# EAGLE design Pyr0-Piezo_Direct_Extruder_Board2.1.1 (EAGLE 9.4.2)
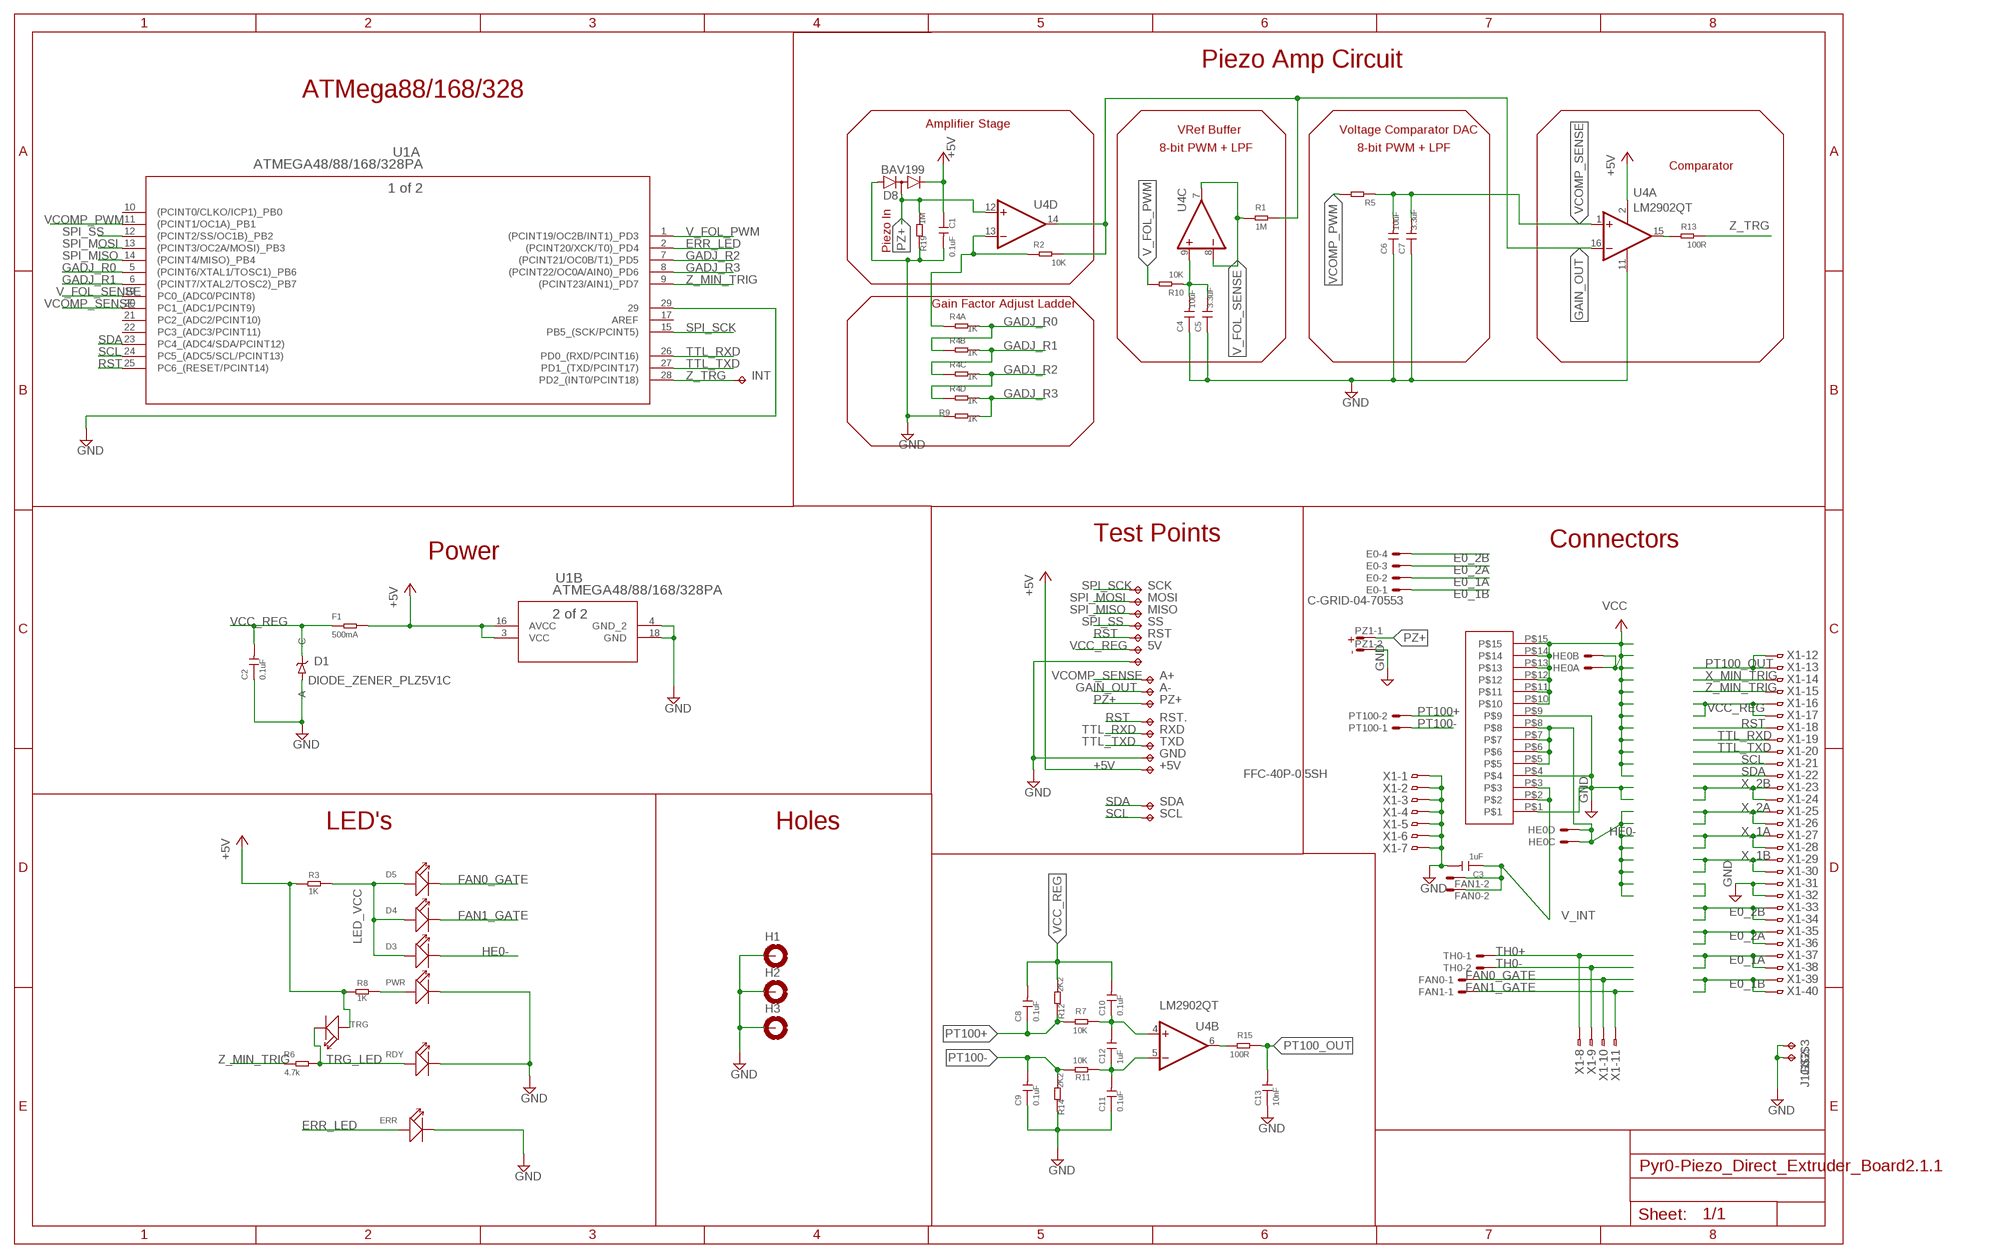
[diagram p0: schematic, sheet 1]

## Parts
5V  TPTP13SQ  [TP13SQ]
+5V  TPTP13SQ  [TP13SQ]
A+  TPTP13SQ  [TP13SQ]
A-  TPTP13SQ  [TP13SQ]
C1  0.1uF  CERAMIC-1NF-50V-10%-X7R(0402)CAP_0402  [CAPC1005X50]
C2  0.1uF  CERAMIC-1NF-50V-10%-X7R(0402)CAP_0402  [CAPC1005X50]
C3  1uF  SEEED-CAPACITOR_CERAMIC-10UF-25V-10%-X5R(0805)CAP_0603_GEN  [CAPC1609X80]
C4  10uF  CERAMIC-1NF-50V-10%-X7R(0402)CAP_0402  [CAPC1005X50]
C5  3.3uF  SEEED-CAPACITOR_CERAMIC-10UF-25V-10%-X5R(0805)CAP_0603_GEN  [CAPC1609X80]
C6  10uF  CERAMIC-1NF-50V-10%-X7R(0402)CAP_0402  [CAPC1005X50]
C7  3.3uF  SEEED-CAPACITOR_CERAMIC-10UF-25V-10%-X5R(0805)CAP_0603_GEN  [CAPC1609X80]
C8  0.1uF  CERAMIC-1NF-50V-10%-X7R(0402)CAP_0402  [CAPC1005X50]
C9  0.1uF  CERAMIC-1NF-50V-10%-X7R(0402)CAP_0402  [CAPC1005X50]
C10  0.1uF  CERAMIC-1NF-50V-10%-X7R(0402)CAP_0402  [CAPC1005X50]
C11  0.1uF  CERAMIC-1NF-50V-10%-X7R(0402)CAP_0402  [CAPC1005X50]
C12  1uF  CERAMIC-1NF-50V-10%-X7R(0402)CAP_0402  [CAPC1005X50]
C13  10nF  CERAMIC-1NF-50V-10%-X7R(0402)CAP_0402  [CAPC1005X50]
D1  DIODE_ZENER_PLZ5V1C  [DO-219AC]
D3  SEEED-LED_SMD-LED-CLEAR-BLUE(0603)LED_0603  [SEEED-LED_LED-0603]
D4  SEEED-LED_SMD-LED-CLEAR-BLUE(0603)LED_0603  [SEEED-LED_LED-0603]
D5  SEEED-LED_SMD-LED-CLEAR-BLUE(0603)LED_0603  [SEEED-LED_LED-0603]
D8  BAV199  [SOT23]
E0  C-GRID-04-70553  [70553-04]
ERR  SEEED-LED_SMD-LED-CLEAR-BLUE(0603)LED_0603  [SEEED-LED_LED-0603]
F1  500mA  SEEED-RESISTOR_SMD-RES-1.5K-1%-1/10W(0603)DETAILED_MODEL  [SEEED-RESISTOR_R0603]
FAN0  CON-MOLEX-2P-1.27MM048  [53048-02]
FAN1  CON-MOLEX-2P-1.27MM048  [53048-02]
GND  TPTP13SQ  [TP13SQ]
H1  HOLES_MOUNT-PAD-ROUND3.2  [HOLES_3,2-PAD]
H2  HOLES_MOUNT-PAD-ROUND3.2  [HOLES_3,2-PAD]
H3  HOLES_MOUNT-PAD-ROUND3.2  [HOLES_3,2-PAD]
HE0  JST-2.54-2X2JST-DUPONT-2.54-2X2  [HDRRAR4W64P254_2X2_556X736X556B]
INT  TPTP06R  [TP06R]
J1  FFC-15P-1MM  [FFC-15P-1MM]
MISO  TPTP13SQ  [TP13SQ]
MOSI  TPTP13SQ  [TP13SQ]
PT100  CON-MOLEX-2P-1.27MM048  [53048-02]
PWR  SEEED-LED_SMD-LED-CLEAR-BLUE(0603)LED_0603  [SEEED-LED_LED-0603]
PZ1  CON-MOLEX-2P-1.27MM048  [53048-02]
PZ+  TPTP13SQ  [TP13SQ]
R1  1M  SMD-RES-0R-5%-1/16W(0402)  [R0402]
R2  10K  SMD-RES-0R-5%-1/16W(0402)  [R0402]
R3  1K  SMD-RES-0R-5%-1/16W(0402)  [R0402]
R4  1K  RESISTOR_NETWORK_X40804  [EXBN8V]
R5  10K  SEEED-RESISTOR_SMD-RES-1.5K-1%-1/10W(0603)DETAILED_MODEL  [SEEED-RESISTOR_R0603]
R6  4.7k  SMD-RES-0R-5%-1/16W(0402)  [R0402]
R7  10K  SMD-RES-0R-5%-1/16W(0402)  [R0402]
R8  1K  SMD-RES-0R-5%-1/16W(0402)  [R0402]
R9  1K  SMD-RES-0R-5%-1/16W(0402)  [R0402]
R10  10K  SMD-RES-0R-5%-1/16W(0402)  [R0402]
R11  10K  SMD-RES-0R-5%-1/16W(0402)  [R0402]
R12  2K2  SMD-RES-0R-5%-1/16W(0402)  [R0402]
R13  100R  SMD-RES-0R-5%-1/16W(0402)  [R0402]
R14  2K2  SMD-RES-0R-5%-1/16W(0402)  [R0402]
R15  100R  SMD-RES-0R-5%-1/16W(0402)  [R0402]
R19  1M  SMD-RES-0R-5%-1/16W(0402)  [R0402]
RDY  SEEED-LED_SMD-LED-CLEAR-BLUE(0603)LED_0603  [SEEED-LED_LED-0603]
RST  TPTP13SQ  [TP13SQ]
RST.  TPTP13SQ  [TP13SQ]
RXD  TPTP13SQ  [TP13SQ]
SCK  TPTP13SQ  [TP13SQ]
SCL  TPTP13SQ  [TP13SQ]
SDA  TPTP13SQ  [TP13SQ]
SS  TPTP06R  [TP06R]
TH0  CON-MOLEX-2P-1.27MM048  [53048-02]
TRG  SEEED-LED_SMD-LED-CLEAR-BLUE(0603)LED_0603  [SEEED-LED_LED-0603]
TXD  TPTP13SQ  [TP13SQ]
U1  ATMEGA48/88/168/328PA  [28M1]
U4  LM2902QT  [QFN16]
X1  FFC-40P-0.5SH  [FH12-40S-0.5SH]
⏚  TPTP13SQ  [TP13SQ]

## Nets
+5V: +5V.TP C1.1 D8.2(C) F1.2 R3.1 R8.1 TRG.+ U1.3(B:VCC) U1.16(B:AVCC) U4.2(P:V+)
E0_1A: E0.2 X1.37 X1.38
E0_1B: E0.1 X1.39 X1.40
E0_2A: E0.3 X1.35 X1.36
E0_2B: E0.4 X1.33 X1.34
ERR_LED: ERR.+ U1.2(A:(PCINT20/XCK/T0)_PD4)
FAN0_GATE: D5.- FAN0.1 X1.10
FAN1_GATE: D4.- FAN1.1 X1.11
GADJ_R0: R4.2 R4.8 U1.5(A:(PCINT6/XTAL1/TOSC1)_PB6)
GADJ_R1: R4.3 R4.7 U1.6(A:(PCINT7/XTAL2/TOSC2)_PB7)
GADJ_R2: R4.4 R4.6 U1.7(A:(PCINT21/OC0B/T1)_PD5)
GADJ_R3: R4.5 R9.2 U1.8(A:(PCINT22/OC0A/AIN0)_PD6)
GAIN_FB: R2.1 R4.1 U4.13(D:-IN)
GAIN_OUT: A-.TP R1.2 R2.2 U4.14(D:OUT) U4.16(A:-IN)
GND: C1.2 C2.1 C3.2 C4.1 C5.1 C6.1 C7.1 C9.1 C11.1 C13.1 D1.P$1(A) D8.1(A) ERR.- GND.TP H1.B3,2(MOUNT) H2.B3,2(MOUNT) H3.B3,2(MOUNT) J1.P$1 J1.P$4 J1.P$9 J1.P$16(TP) J1.P$17(TP) PWR.- PZ1.2 R9.1 R14.1 R19.1 RDY.- U1.4(B:GND_2) U1.18(B:GND) U1.29 U4.11(P:V-) X1.1 X1.2 X1.3 X1.4 X1.5 X1.6 X1.7 X1.31 X1.32 ⏚.TP
HE0-: D3.- HE0.3 HE0.4 J1.P$5 J1.P$6 J1.P$7 J1.P$8
LED_VCC: D3.+ D4.+ D5.+ R3.2
N$2: PWR.+ R8.2
PT100+: C8.1 PT100.2 R7.2 R12.1
PT100-: C9.2 PT100.1 R11.2 R14.2
PT100_AMP+: C10.1 C12.2 R7.1 U4.4(B:+IN)
PT100_AMP-: C11.2 C12.1 R11.1 U4.5(B:-IN)
PT100_OUT: C13.2 R15.1 X1.12 X1.13
PT100_R: R15.2 U4.6(B:OUT)
PZ+: D8.3(AC) PZ1.1 PZ+.TP R19.2 U4.12(D:+IN)
PZ_AMP_OUT: R13.1 U4.15(A:OUT)
RST: RST..TP RST.TP U1.25(A:PC6_(RESET/PCINT14)) X1.18
SCL: SCL.TP U1.24(A:PC5_(ADC5/SCL/PCINT13)) X1.21
SDA: SDA.TP U1.23(A:PC4_(ADC4/SDA/PCINT12)) X1.22
SPI_MISO: MISO.TP U1.14(A:(PCINT4/MISO)_PB4)
SPI_MOSI: MOSI.TP U1.13(A:(PCINT3/OC2A/MOSI)_PB3)
SPI_SCK: SCK.TP U1.15(A:PB5_(SCK/PCINT5))
SPI_SS: SS.TP U1.12(A:(PCINT2/SS/OC1B)_PB2)
TH0+: TH0.1 X1.8
TH0-: TH0.2 X1.9
TRG_LED: R6.2 RDY.+ TRG.-
TTL_RXD: RXD.TP U1.26(A:PD0_(RXD/PCINT16)) X1.19
TTL_TXD: TXD.TP U1.27(A:PD1_(TXD/PCINT17)) X1.20
V_FOL_PWM: R10.2 U1.1(A:(PCINT19/OC2B/INT1)_PD3)
V_FOL_SENSE: R1.1 U1.19(A:PC0_(ADC0/PCINT8)) U4.7(C:OUT) U4.8(C:-IN)
V_INT: C3.1 FAN0.2 FAN1.2 J1.P$2 J1.P$3
VCC: HE0.1 HE0.2 J1.P$10 J1.P$11 J1.P$12 J1.P$13 J1.P$14 J1.P$15
VCC_REG: 5V.TP C2.2 C8.2 C10.2 D1.P$2(C) F1.1 R12.2 X1.16 X1.17
VCOMP_PWM: R5.2 U1.11(A:(PCINT1/OC1A)_PB1)
VCOMP_SENSE: A+.TP C6.2 C7.2 R5.1 U1.20(A:PC1_(ADC1/PCINT9)) U4.1(A:+IN)
VREF_IN: C4.2 C5.2 R10.1 U4.9(C:+IN)
X_1A: X1.27 X1.28
X_1B: X1.29 X1.30
X_2A: X1.25 X1.26
X_2B: X1.23 X1.24
X_MIN_TRIG: X1.14
Z_MIN_TRIG: R6.1 U1.9(A:(PCINT23/AIN1)_PD7) X1.15
Z_TRG: INT.TP R13.2 U1.28(A:PD2_(INT0/PCINT18))
Unconnected: U1.10(A:(PCINT0/CLKO/ICP1)_PB0) U1.17(A:AREF) U1.21(A:PC2_(ADC2/PCINT10)) U1.22(A:PC3_(ADC3/PCINT11))

## Notes on the sheet
- Piezo Amp Circuit
- ATMega88/168/328
- Amplifier Stage
- VRef Buffer | Voltage Comparator DAC
- 8-bit PWM + LPF | 8-bit PWM + LPF
- Comparator
- Piezo In
- Gain Factor Adjust Ladder
- Test Points | Connectors
- Power
- -  +
- LED's | Holes

## Library data of the parts
5V A+ A- MISO MOSI PZ+ RST SCK = PiezoFFC:TP: Test pad
+5V GND INT RST. RXD SCL SDA SS TXD ⏚ = testpad:TP: Test pad
C1 C2 C4 C6 C8-C13 = PiezoFFC:CERAMIC-1NF-50V-10%-X7R(0402): 302010005
C3 C5 C7 = PiezoFFC:SEEED-CAPACITOR_CERAMIC-10UF-25V-10%-X5R(0805): 302010178
D1 = PiezoFFC:DIODE_ZENER_PLZ5V1C
D3-D5 ERR PWR RDY TRG = PiezoFFC:SEEED-LED_SMD-LED-CLEAR-BLUE(0603): 304090045
D8 = PiezoFFC:BAV199: DIODE low-leakage double diode
E0 = PiezoFFC:C-GRID-04: CONNECTOR wire to board 2.54 mm (0.100") pitch header; MF: MOLEX; OC_FARNELL: unknown; OC_NEWARK: unknown
F1 R5 = PiezoFFC:SEEED-RESISTOR_SMD-RES-1.5K-1%-1/10W(0603): 301010189
FAN0 FAN1 PT100 PZ1 TH0 = PiezoFFC:CON-MOLEX-2P-1.27MM: CONNECTOR wire to board 1.25 mm (.049 inch) pitch header; MF: MOLEX; MPN: 53048-0210; OC_FARNELL: 1012259; OC_NEWARK: 57H4718
H1-H3 = PiezoFFC:HOLES_MOUNT-PAD-ROUND: MOUNTING PAD, round
HE0 = PiezoFFC:JST-2.54-2X2
J1 = PiezoFFC:FFC-15P-1MM
R1-R3 R6-R15 R19 = PiezoFFC:SMD-RES-0R-5%-1/16W(0402): 301010000; MPN: RC0402JR-070RL; VALUE: 0R
R4 = PiezoFFC:RESISTOR_NETWORK_X4
U1 = PiezoFFC:ATMEGA48/88/168/328PA; MANUFACTURER_PART_NUMBER: ATMEGA48PAMMHR; VENDOR: Atmel
U4 = PiezoFFC:LM2902: Low power quad operational amplifier Source: Data sgeet <http://www.st.com/internet/com/TECHNICAL_RESOURCES/TECHNICAL_LITERATURE/DATASHEET/CD00000533.pdf>
X1 = PiezoFFC:FFC-40P-0.5S: 0.5mm Pitch Connectors For FPC/FFC Source: Data sheet <http://www.hirose.co.jp/cataloge_hp/e58605370.pdf>; MPN: FH12-40S-0.5SH(55); OC_FARNELL: 1324556; OC_NEWARK: 34M6178

## Board
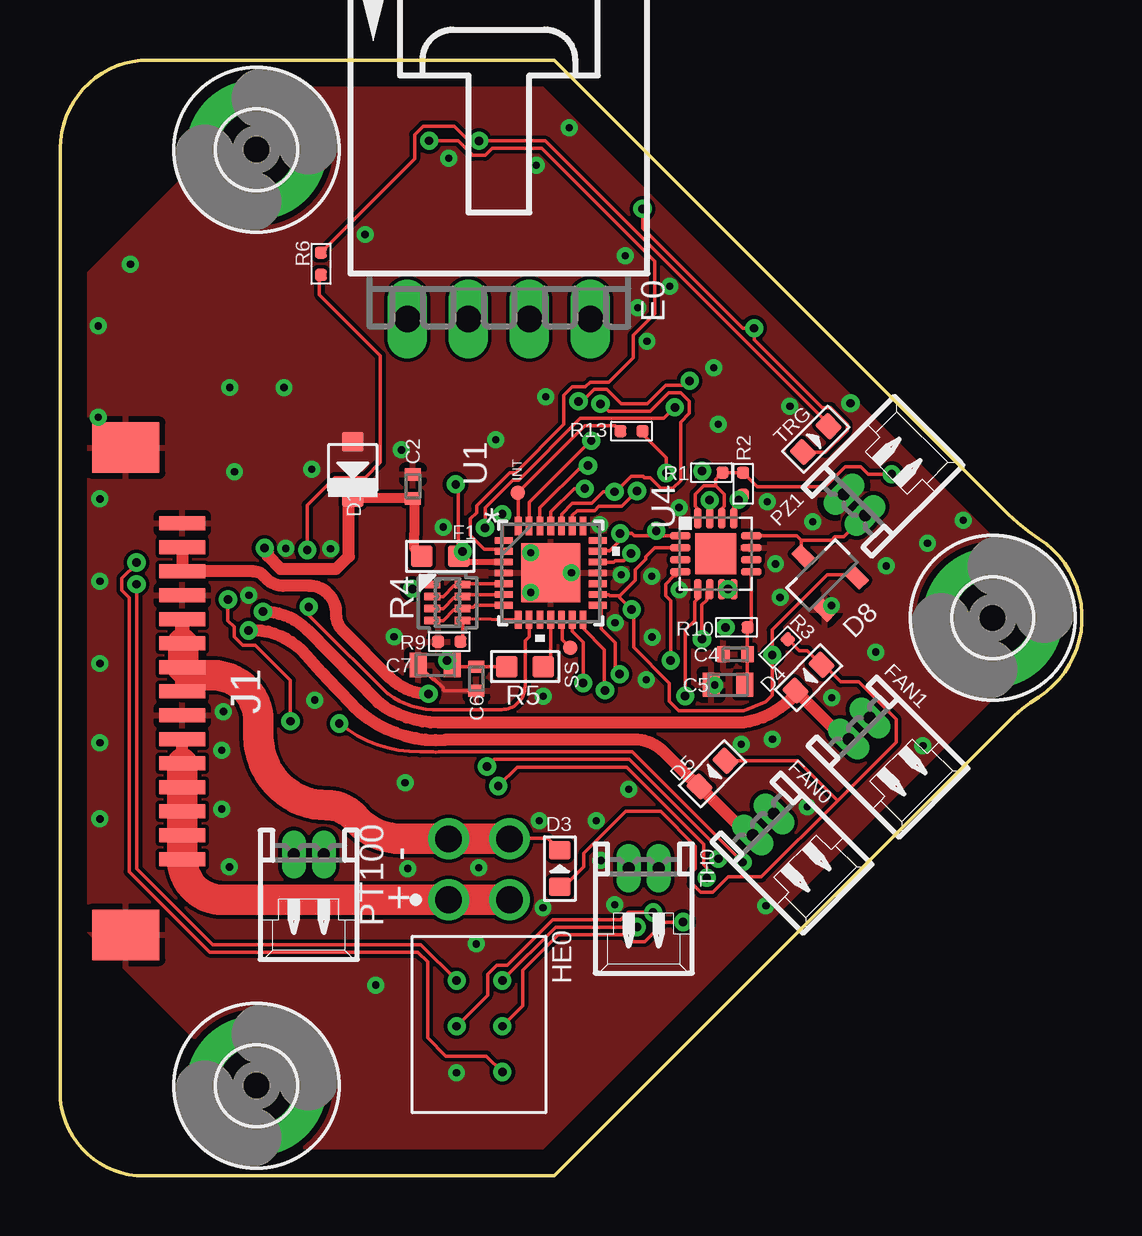
[diagram p1: board, top side]
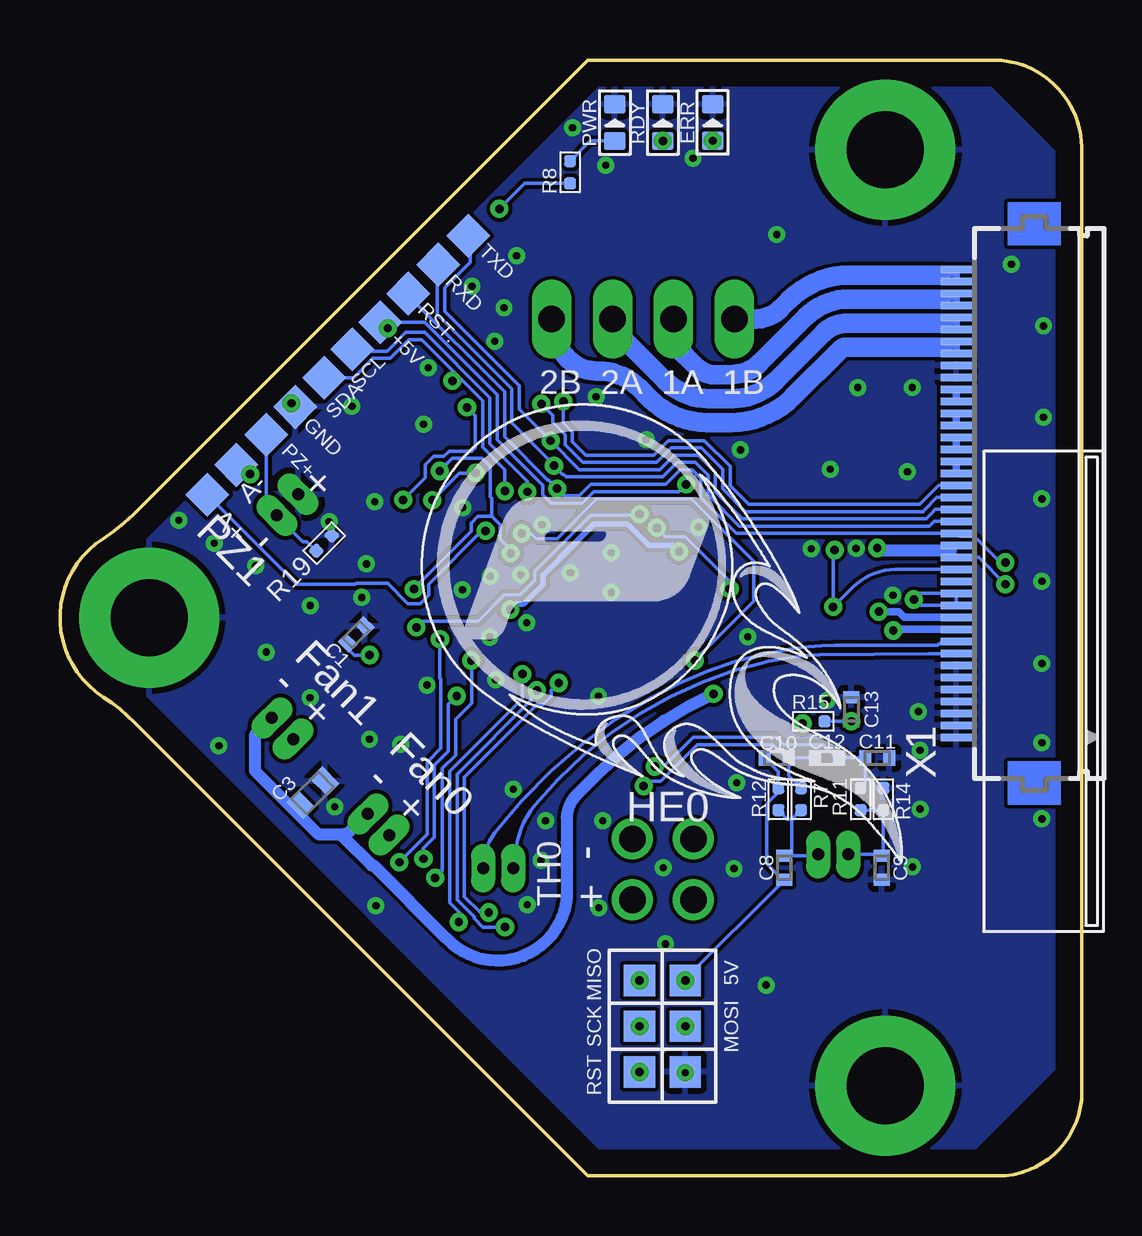
[diagram p2: board, bottom side, seen from below]

Size 42.58 x 46.48 mm. Coordinates in mm from the lower left corner, seen from the top.
Outline: 22.46,1.87 39.46,18.87 arc-12 40.78,19.94 arc114 40.78,26.54 arc-12 39.51,27.56 20.59,46.48 8.14,46.48 3.7,46.48 arc90 0.01,42.8 0.01,3.81 arc90 3.19,0 8.27,0 20.59,0 22.46,1.87
Copper layers (1*16): Top 0.035mm / dielectric 1.5mm / Bottom 0.035mm
Design rules "default *": minimum track width 6mil, minimum drill 0.35mm, track to track 6mil, track to pad 6mil, pad to pad 6mil, via to via 6mil, smd to smd 6mil, copper to edge 40mil, drill to drill 6mil, minimum pad ring 10mil, minimum via ring 8mil, stop-mask expansion 4mil, vias tented up to drill 4mm, thermal gap 10mil

### Footprints (pad centres in the part's own frame; a part is rotated, then mirrored left to right if it is on the bottom)
TP13SQ = smd 1.3 x 1.3: TP 0,0
CAPC1005X50 = smd 0.512 x 0.662: 1 -0.5,0; 2 0.5,0
CAPC1609X80 = smd 0.712 x 1.012: 1 -0.7,0; 2 0.7,0
DO-219AC = smd 0.8 x 0.9: P$1 -1.15,0; P$2 1.15,0
SEEED-LED_LED-0603 = smd 0.762 x 0.889: + -0.762,0; - 0.762,0
SOT23 = smd 0.6 x 0.9: 1 -0.95,-1.1; 2 0.95,-1.1; 3 0,1.1
70553-04 = drill 1.092 long: 1 -3.81,-7.62; 2 -1.27,-7.62; 3 1.27,-7.62; 4 3.81,-7.62
SEEED-RESISTOR_R0603 = smd 0.889 x 0.889: 1 0,0.762; 2 0,-0.762
53048-02 = drill 0.5 pad 0.698 long: 1 0.625,-1.25; 2 -0.625,-1.25
HOLES_3,2-PAD = drill 3.2 pad 5.842: B3,2 0,0
HDRRAR4W64P254_2X2_556X736X556B = drill 1.105 pad 1.705: 1 0,0; 2 2.54,0; 3 2.54,2.54; 4 0,2.54
TP06R = smd 0.6 x 0.6: TP 0,0
FFC-15P-1MM = smd 0.6 x 1.9: P$1 0,0; P$2 1,0; P$3 2,0; P$4 3,0; P$5 4,0; P$6 5,0; P$7 6,0; P$8 7,0; P$9 8,0; P$10 9,0; P$11 10,0; P$12 11,0; P$13 12,0; P$14 13,0; P$15 14,0 | smd 2.1 x 2.8: P$16 -3.15,-2.35; P$17 17.15,-2.35
R0402 = smd 0.5 x 0.5: 1 0,0.463; 2 0,-0.463
EXBN8V = smd 0.657 x 0.3: 1 -0.629,0.75; 2 -0.629,0.25; 3 -0.629,-0.25; 4 -0.629,-0.75; 5 0.629,-0.75; 6 0.629,-0.25; 7 0.629,0.25; 8 0.629,0.75
28M1 = smd 0.762 x 0.279: 1 -1.956,1.35; 2 -1.956,0.9; 3 -1.956,0.45; 4 -1.956,0; 5 -1.956,-0.45; 6 -1.956,-0.9; 7 -1.956,-1.35; 15 1.956,-1.35; 16 1.956,-0.9; 17 1.956,-0.45; 18 1.956,0; 19 1.956,0.45; 20 1.956,0.9; 21 1.956,1.35 | smd 0.279 x 0.762: 8 -1.35,-1.956; 9 -0.9,-1.956; 10 -0.45,-1.956; 11 0,-1.956; 12 0.45,-1.956; 13 0.9,-1.956; 14 1.35,-1.956; 22 1.35,1.956; 23 0.9,1.956; 24 0.45,1.956; 25 0,1.956; 26 -0.45,1.956; 27 -0.9,1.956; 28 -1.35,1.956 | smd 2.464 x 2.464: 29 0,0
QFN16 = smd 0.85 x 0.3: 1 -1.475,0.75; 2 -1.475,0.25; 3 -1.475,-0.25; 4 -1.475,-0.75; 9 1.475,-0.75; 10 1.475,-0.25; 11 1.475,0.25; 12 1.475,0.75 | smd 0.3 x 0.85: 5 -0.75,-1.475; 6 -0.25,-1.475; 7 0.25,-1.475; 8 0.75,-1.475; 13 0.75,1.475; 14 0.25,1.475; 15 -0.25,1.475; 16 -0.75,1.475 | smd 1.7 x 1.7: TH 0,0
FH12-40S-0.5SH = smd 0.3 x 1.3: 1 -9.75,3.25; 2 -9.25,3.25; 3 -8.75,3.25; 4 -8.25,3.25; 5 -7.75,3.25; 6 -7.25,3.25; 7 -6.75,3.25; 8 -6.25,3.25; 9 -5.75,3.25; 10 -5.25,3.25; 11 -4.75,3.25; 12 -4.25,3.25; 13 -3.75,3.25; 14 -3.25,3.25; 15 -2.75,3.25; 16 -2.25,3.25; 17 -1.75,3.25; 18 -1.25,3.25; 19 -0.75,3.25; 20 -0.25,3.25; 21 0.25,3.25; 22 0.75,3.25; 23 1.25,3.25; 24 1.75,3.25; 25 2.25,3.25; 26 2.75,3.25; 27 3.25,3.25; 28 3.75,3.25; 29 4.25,3.25; 30 4.75,3.25; 31 5.25,3.25; 32 5.75,3.25; 33 6.25,3.25; 34 6.75,3.25; 35 7.25,3.25; 36 7.75,3.25; 37 8.25,3.25; 38 8.75,3.25; 39 9.25,3.25; 40 9.75,3.25

### Placement (x,y rotation side)
5V  16.52,8.13 0 bottom
+5V  29.24,35.56 135 bottom
A+  36.45,28.36 45 bottom
A-  35.23,29.61 225 bottom
C1  30.24,22.54 45 bottom
C2  14.71,28.71 270 top
C3  32.05,15.94 45 bottom
C4  28.14,21.72 0 top
C5  27.83,20.45 0 top
C6  17.35,20.7 90 top
C7  15.64,21.27 0 top
C8  12.4,12.83 270 bottom
C9  8.33,12.83 90 bottom
C10  12.71,17.4 180 bottom
C11  8.52,17.4 180 bottom
C12  10.62,17.4 180 bottom
C13  9.6,19.43 270 bottom
D1  12.2,29.43 270 top
D3  20.83,12.79 90 top
D4  31.19,20.75 225 top
D5  27.19,16.75 225 top
D8  31.75,25.02 45 top
E0  18.29,43.31 0 top
ERR  15.38,43.88 90 bottom
F1  15.84,25.8 90 top
FAN0  30.19,13.75 225 top
FAN1  34.19,17.75 225 top
GND  32.78,32.02 315 bottom
H1  8.19,3.75 0 top
H2  8.19,42.75 0 top
H3  38.86,23.24 0 top
HE0  16.19,11.49 0 top
INT  19.08,28.45 180 top
J1  5.09,27.18 270 top
MISO  18.43,8.13 0 bottom
MOSI  16.52,6.22 0 bottom
PT100  10.36,12.13 180 top
PWR  19.46,43.87 90 bottom
PZ1  33.99,28.83 315 top
PZ+  33.99,30.86 45 bottom
R1  27.14,29.29 90 top
R2  28.46,28.83 180 top
R3  30.01,22.02 135 top
R4  16.14,23.88 0 top
R5  19.38,21.21 90 top
R6  10.87,37.99 180 top
R7  11.7,15.68 0 bottom
R8  21.32,41.8 180 bottom
R9  16.22,22.24 90 top
R10  28.19,22.84 270 top
R11  9.22,15.68 0 bottom
R12  12.65,15.68 180 bottom
R13  23.81,31.02 270 top
R14  8.27,15.68 0 bottom
R15  11.19,18.92 270 bottom
R19  31.57,26.35 315 bottom
RDY  17.46,43.87 90 bottom
RST  18.43,4.32 0 bottom
RST.  28.07,36.75 315 bottom
RXD  26.82,37.96 135 bottom
SCK  18.43,6.22 0 bottom
SCL  30.41,34.42 315 bottom
SDA  31.57,33.24 315 bottom
SS  21.27,21.99 90 top
TH0  24.32,11.56 180 top
TRG  31.49,30.68 45 top
TXD  25.57,39.16 135 bottom
U1  20.45,25.11 0 top
U4  27.32,25.91 0 top
U$1  [LOGO-PYR0BALL-SS-20MM]  20.73,25.51 0 bottom
X1  1.98,28 90 bottom
⏚  16.52,4.32 0 bottom

### Tracks (layer width: path | path; a pad name or v marks a point on that pad's centre or on a via)
+5V  (via drill 0.35)
  Top 0.152: v24.27,40.28 24.27,39.48 28.45,35.31 v28.92,35.31 28.92,34.83 31.76,32 32.12,32 32.8,31.31 32.8,31.04 31.89,30.13 30.96,30.13 TRG.+ | D8.2 33.08,25.04 31.98,25.04 29.68,22.74 R3.1 29.68,20.01 29.41,19.75 28.49,19.37 25.79,19.37 25.39,19.77 25.39,20.52 23.9,22.01 23.9,23.5 v23.82,23.59 23.33,24.08 | U1.16 22.86,24.21 22.91,24.15 23.25,24.15 23.33,24.08 | v16.49,28.8 16.59,28.7 16.59,25.82 F1.2 | U4.2 24.78,26.16 24.4,25.79 24.4,25.67 23.96,25.23 23.96,24.8 23.33,24.16 23.33,24.08
  Top 0.254: U1.3 16.87,25.56 16.63,25.8 F1.2 16.61,25.83 v16.78,26
  Bottom 0.152: v24.27,40.28 23.22,41.34 R8.1 | R3.1 30.32,21.69 30.61,21.98 30.61,22.17 C1.1 | +5V.TP 28.99,35.31 v28.92,35.31 28.67,35.56 27.39,35.56 24.36,32.53 24.36,30.65 22.49,28.79 22.47,28.77 22.47,28.37 22.12,28.02 20.82,28.02 20.33,28.5 16.79,28.5 v16.49,28.8
  Bottom 0.254: v23.82,23.59 23.57,23.84 23.26,23.84 22.44,24.65 22.44,25.02 21.75,25.72 | 21.75,25.72 | 21.75,25.72 20.31,27.15 18.95,27.15 18.05,26.26 17.03,26.26 v16.78,26
  other vias: 29.68,21.69
E0_1A
  Bottom 0.305: X1.37 X1.38 arc45 5.79,36.52 5.86,36.52
  Bottom 0.813: E0.2 17.02,35.35 arc-45 16.52,34.16 16.02,33.65 arc-45 15.34,33.37 14.61,33.37 arc-45 13.41,33.87 11.5,35.78 arc45 9.71,36.52 5.86,36.52
E0_1B
  Bottom 0.305: X1.39 X1.40 arc45 5.79,37.52 5.86,37.52
  Bottom 0.813: E0.1 13.61,35.69 arc-45 12.56,36.12 12.22,36.47 arc45 9.67,37.52 5.86,37.52
E0_2A
  Bottom 0.305: X1.35 X1.36 arc45 5.79,35.52 5.81,35.52
  Bottom 0.813: E0.3 arc-45 19.3,35.06 17.35,33.12 arc-45 15.56,32.37 14.56,32.37 arc-45 12.77,33.12 10.78,35.1 arc45 9.76,35.52 5.81,35.52
E0_2B
  Bottom 0.305: X1.33 X1.34 arc45 5.79,34.52 5.81,34.52
  Bottom 0.813: E0.4 E0.4 arc-45 21.41,34.02 arc-45 20.2,33.52 20.16,33.52 arc45 18.45,32.82 18.01,32.37 arc-45 15.6,31.37 14.62,31.37 arc-45 12.04,32.44 10.07,34.41 arc45 9.81,34.52 5.81,34.52
ERR_LED  (via drill 0.35)
  Top 0.152: ERR.+ 16.6,43.12 17.21,42.5 17.71,42.5 18.01,42.81 20.07,42.81 24.78,38.1 24.78,35.91 23.88,35.01 23.88,34.07 22.87,33.06 22.09,33.06 21.89,32.86 21.35,32.86 21,32.51 21,31.3 18.99,29.28 18.73,29.28 17.35,27.91 17.35,27.62 17.1,27.37 17.1,26.67 17.68,26.09 18.46,26.09 U1.2
  other vias: 15.38,43.12
FAN0_GATE  (via drill 0.35)
  Top 0.508: FAN0.1 28.67,14.19 D5.- 26.18,16.64 25.16,17.65 arc50 23.76,18.16 16.08,18.16 arc-49 12.2,19.59 arc-5 10.25,21.69 arc41 8.4,22.71 v7.86,22.71
  Bottom 0.305: v7.86,22.71 7.66,22.71 7.61,22.75 X1.10
FAN1_GATE  (via drill 0.35)
  Top 0.508: FAN1.1 32.67,18.19 D4.- 30.65,20.06 30.46,19.87 arc-37 28.46,18.87 15.77,18.87 arc-37 13.26,19.71 arc1 10.3,22.74 arc45 v8.46,23.5
  Bottom 0.305: v8.46,23.5 7.63,23.5 7.39,23.25 X1.11
GADJ_R0
  Top 0.152: U1.5 16.81,24.66 R4.8 16.71,24.57 16.41,24.57 15.97,24.13 R4.2
GADJ_R1
  Top 0.152: U1.6 18.52,24.19 16.84,24.19 R4.7 16.71,24.07 16.41,24.07 15.97,23.63 R4.3
GADJ_R2
  Top 0.152: U1.7 17.3,23.76 17.23,23.69 16.84,23.69 R4.6 16.71,23.57 16.41,23.57 15.97,23.13 R4.4
GADJ_R3
  Top 0.152: U1.8 16.85,23.21 R4.5 16.77,22.34 R9.2
GAIN_FB  (via drill 0.35)
  Top 0.152: U4.13 28.07,27.97 R2.1 28.46,28.33 v28.28,28.15 | v25.62,32.01 25.16,31.55 21.68,31.55 19.11,28.98 18.86,28.98 17.71,27.83 v17.71,26.99 | R4.1 15.45,24.56 14.8,24.56 v14.68,24.45
  Bottom 0.152: v28.28,28.15 27.36,29.07 27.36,29.61 27.01,29.96 26.58,29.96 26.36,30.19 25.41,30.19 25.27,30.33 25.27,31.67 v25.62,32.01 | v17.71,26.99 17.33,26.61 16.53,26.61 14.71,24.8 14.71,24.48 v14.68,24.45
GAIN_OUT  (via drill 0.35)
  Top 0.152: 27.32,28.75 26.82,28.75 26.46,28.39 26.46,27.89 26.57,27.78 U4.16 | 27.32,28.75 27.68,28.39 27.68,27.89 27.57,27.78 U4.14 | 27.32,28.75 27.32,29 R1.2 R2.2 29.05,28.7 31.89,28.7 32.72,29.53 33.37,29.53 33.67,29.23 v34.66,29.23
  Bottom 0.152: A-.TP 35.04,29.61 v34.66,29.23
GND  (via drill 0.3, 0.35)
  Top 0.152: C6.1 16.01,20.2 15.96,20.25 15.96,20.32 15.6,20.68 15.53,20.68 C7.1
  other vias: 23.38,25.04 27.43,31.31 23.56,38.33 21.31,25.12 10.49,29.43 35.96,17.91 29.68,18.18 2.94,37.97 36.15,26.35 1.67,28.19 1.67,24.77 1.67,21.34 1.67,18.03 1.67,14.86 13.16,7.94 6.75,17.72 7.87,24.18 15.97,27.02 11.27,26.12 20.24,32.45 19.97,14.78 24.67,22.44 22.35,14.78 21.22,43.66 28.38,17.97 24.43,20.66 31.13,15.37 29.41,11.24 23.13,23.03 27.29,20.44 17.44,12.83 37.64,27.3 19.84,42.1 27.24,33.65 30.41,32.05 19.61,25.95 32.16,19.91 7.07,32.84 7.27,29.33 32.94,32.18 18.16,30.66 34.43,25.4 22.49,27.11 32.15,23.75 24.65,24.98 25.79,27.83 29.81,25.49 30,24.09 25.81,24.41 9.41,26.13 14.23,30.24 13.92,22.45 20.14,19.97 23.7,16.1 6.74,15.27 7.06,12.86 24.46,34.77 16.2,42.39 12.71,39.21 33.98,21.81 6.81,19.34 10.62,19.81 24.08,36.16 25.41,37.05 1.6,31.59 1.6,35.4 16.52,4.29 17.35,9.65 22.54,13.13 23.11,11.29 20.12,11.16 14.38,16.37 19.61,24.3 14.49,12.79 29.46,28.07 31.37,27.25 9.33,32.83
  pour Top: 1.01,37.43 1.01,10.32 10.46,0.87 20.46,0.87 39.46,19.87 39.46,26.87 20.46,45.87 9.46,45.87
  pour Bottom: 1.01,42.51 1.01,4.6 4.47,1.14 20.08,1.14 39.26,20.32 39.26,26.16 20.08,45.34 3.84,45.34
HE0-
  Top 0.152: D3.- 20.32,14.06 18.76,14.06 HE0.3
  Top 0.61: J1.P$6 J1.P$5 | J1.P$7 J1.P$8
  Top 1.27: HE0.3 HE0.4 14.21,14.03 arc-45 12.42,14.78 12.21,14.98 arc45 11.13,15.43 arc-90 8.27,18.29 8.27,18.95 arc90 6.37,20.85 5.43,20.85 5.13,21.15 | 5.13,21.15 J1.P$7 | J1.P$6 5.13,22.15 5.13,21.15
LED_VCC
  Top 0.152: D5.+ 30.74,17.29 32.4,15.62 | 32.4,15.62 34.84,18.06 34.84,19.02 33.28,20.57 32.53,20.57 31.82,21.29 D4.+ 31.14,21.87 30.81,21.87 R3.2 | 32.4,15.62 29.22,12.45 27.85,12.45 27.2,11.8 26.7,11.8 26.34,12.15 26.34,12.65 26.47,12.79 26.47,13.73 25.02,15.18 23.57,15.18 21.83,13.43 21.83,12.86 21,12.03 D3.+
N$2
  Bottom 0.152: PWR.+ 20.48,43.11 R8.2
PT100+
  Bottom 0.152: C8.1 12.08,13.33 | 12.08,13.33 11.04,13.33 PT100.2 | 12.08,14.84 12.08,13.33 | R12.1 12.27,14.84 12.08,14.84 | 12.08,14.84 R7.2
PT100-
  Bottom 0.152: R14.2 8.27,15.11 | 8.27,15.11 8.27,13.39 C9.2 8.38,13.38 PT100.1 | R11.2 8.38,15.22 8.27,15.11
PT100_AMP+  (via drill 0.35)
  Top 0.152: U4.4 25.67,24.99 25.57,24.99 25.23,24.65 25.23,24.17 25.44,23.95 v25.44,21.46 | v26.95,12.4 26.95,12.83 26.83,12.95 26.83,13.81 23.61,17.02 19.04,17.02 v18.26,16.23
  Bottom 0.152: v25.44,21.46 25.41,21.44 25.41,19.69 26.1,19 26.1,17.52 26.65,16.97 26.65,12.7 v26.95,12.4 | C12.2 C10.1 | R7.1 12.21,16.66 C10.1 | C10.1 12.3,17.4 12.86,17.96 16.02,17.96 17.54,16.44 18.05,16.44 v18.26,16.23
PT100_AMP-  (via drill 0.35)
  Top 0.152: U4.5 26.57,24.03 26.44,23.91 26.44,23.13 26.05,22.73 v26.05,19.98 | v27.43,13.2 27.43,13.63 23.72,17.35 18.1,17.35 v17.79,17.05
  Bottom 0.152: v26.05,19.98 26.4,19.63 26.4,17.68 26.98,17.1 26.98,14.09 27.43,13.63 v27.43,13.2 | R11.1 9.02,16.35 C11.2 C12.1 10.21,17.4 10.77,17.96 12.43,17.96 12.74,18.26 16.2,18.26 17.41,17.05 v17.79,17.05
PT100_OUT  (via drill 0.35)
  Top 0.152: C13.2 9.6,20.64 8.14,22.1 7.61,22.1 7.25,22.46 7.25,22.86 7,23.11 v7,24
  Bottom 0.152: R15.1 C13.2 | v7,24 6.75,23.75 X1.12 X1.13 6.75,24.25 v7,24
  other vias: 9.6,18.93
PT100_R  (via drill 0.35)
  Top 0.152: U4.6 26.95,24.31 26.95,23.98 26.75,23.78 v26.75,22.35 | v28.44,13.06 23.84,17.65 15.77,17.65 15.65,17.64 15.55,17.65 15,17.65 arc-39 v11.64,18.84
  Bottom 0.152: v26.75,22.35 26.75,20.72 26.71,20.68 26.71,17.8 27.28,17.23 27.28,14.21 v28.44,13.06 | R15.2 11.65,18.86 v11.64,18.84
PZ+
  Top 0.152: U4.12 30.7,26.66 30.88,26.48 | 30.88,26.48 32.15,26.48 32.29,26.62 32.66,26.62 PZ1.1 | D8.3 30.88,25.9 30.88,26.48
  Bottom 0.152: R19.2 32.29,26.42 32.46,26.42 PZ1.1 33.99,27.95 PZ+.TP
PZ_AMP_OUT  (via drill 0.35)
  Top 0.152: U4.15 v27.07,28.14 | v25.26,29.27 25.26,29.91 24.27,30.9 R13.1
  Bottom 0.152: v27.07,28.14 25.94,29.27 v25.26,29.27
RST  (via drill 0.35)
  Top 0.152: U1.25 20.45,27.65 21.42,28.62 v21.86,28.62 | 21.88,28.62 v21.86,28.62 | 21.88,28.62 v21.86,28.62 | RST.TP 17.77,4.98 16.08,4.98 15.32,5.75 15.32,8.9 14.91,9.31 6.24,9.31 2.88,12.66 2.88,24.09 2.58,24.39 2.58,24.89 3.19,25.5 v3.19,25.55
  Bottom 0.152: RST..TP 28.07,36.67 24.06,32.66 24.06,30.78 22.25,28.97 22.22,28.97 v21.86,28.62 21.56,28.32 20.94,28.32 20.46,28.8 17.34,28.8 16.74,29.41 16.24,29.41 15.88,29.05 15.88,28.24 14.4,26.75 X1.18 5.11,26.64 4.49,26.64 3.4,25.55 v3.19,25.55
  other vias: 18.43,4.32
SCL  (via drill 0.35)
  Top 0.152: U1.24 20.9,27.55 21.35,28.01 22.15,28.01 22.63,28.49 v23.1,28.49 23.15,28.49 23.79,29.13 24.3,29.13 24.35,29.08 24.59,29.08 25.03,28.64 25.54,28.64 25.86,28.96 25.86,29.02 25.87,29.02 25.87,29.53 25.86,29.53 25.86,31.39 26.23,31.76 26.23,32.26 25.87,32.62 25.37,32.62 24.6,31.85 22.87,31.85 22.57,32.15 v22.52,32.15
  Bottom 0.152: SCL.TP 30.33,34.35 28.95,34.35 28.18,35.13 27.39,35.13 24.67,32.4 24.67,30.5 23.1,28.94 v23.1,28.49 | v22.52,32.15 22.05,31.68 22.05,31.39 21.53,30.87 21.53,30.44 20.81,29.72 17.72,29.72 17.12,30.32 15.86,30.32 14.97,29.43 14.97,28.61 14.02,27.67 6.62,27.67 6.54,27.74 6.54,27.75 6.04,28.25 X1.21
SDA  (via drill 0.35)
  Top 0.152: U1.23 21.35,27.51 21.54,27.7 22.27,27.7 22.45,27.88 23.4,27.88 v24.04,28.53 | v26.23,33.11 26.04,32.92 25.24,32.92 24.48,32.16 23.38,32.16 22.77,32.76 22.27,32.76 21.91,32.4 21.91,32.36 21.71,32.16 v21.6,32.26
  Bottom 0.152: SDA.TP 30.35,33.24 29.54,34.05 28.83,34.05 28.05,34.82 27.51,34.82 25.81,33.11 | v24.04,28.53 24.04,29.41 24.97,30.34 24.97,32.28 25.81,33.11 | 25.81,33.11 v26.23,33.11 | v21.6,32.26 21.6,31.37 21.23,31 21.23,30.57 20.68,30.02 17.85,30.02 17.24,30.63 15.73,30.63 14.66,29.56 14.66,28.75 13.88,27.97 6.75,27.97 5.97,28.75 X1.22
SPI_MISO  (via drill 0.35)
  Top 0.152: U1.14 21.8,22.8 22.68,21.91 22.68,20.24 v22.71,20.22 | v24.04,10.36 23.5,10.36 20.66,10.36 MISO.TP
  Bottom 0.152: v22.71,20.22 22.94,19.99 22.94,19.82 26.04,16.72 26.04,11.49 25.32,10.78 25.32,10.71 24.97,10.36 v24.04,10.36
  other vias: 18.43,8.13
SPI_MOSI  (via drill 0.35)
  Top 0.152: U1.13 21.35,22.67 21.8,22.22 v21.8,20.53 | v24.72,10.96 23.68,10.96 23.38,10.66 20.53,10.66 18.63,8.76 18.21,8.76 17.82,8.38 17.82,7.52 MOSI.TP
  Bottom 0.152: v21.8,20.53 22.1,20.23 22.1,19.97 22.46,19.61 22.72,19.61 25.73,16.59 25.73,11.62 25.1,10.99 24.72,10.99 v24.72,10.96
  other vias: 16.52,6.22
SPI_SCK  (via drill 0.35)
  Top 0.152: v23.32,20.89 23.13,21.08 23.13,22.21 22.55,22.79 22.55,23.62 U1.15 | v25.96,10.56 25.17,10.56 24.36,9.75 23.79,9.75 23.51,10.03 20.76,10.03 19.28,8.55 19.28,7.07 SCK.TP
  Bottom 0.152: v23.32,20.89 23.32,19.87 26.34,16.85 26.34,11.37 25.91,10.93 25.91,10.62 v25.96,10.56
  other vias: 18.43,6.22
SPI_SS
  Top 0.152: SS.TP 20.93,22.33 20.93,23.18 U1.12
TH0+
  Bottom 0.152: TH0.1 23.57,13.65 arc31 22.79,15.42 arc38 13.05,21.43 arc11 10.92,21.7 6.39,21.73 5.25,21.73 X1.8
TH0-
  Bottom 0.152: TH0.2 arc39 24.46,14.29 arc23 17.91,19.94 arc21 11.95,21.98 arc8 10.3,22.1 6.01,22.1 5.98,22.13 5.95,22.13 5.83,22.25 X1.9
TRG_LED  (via drill 0.35)
  Top 0.152: R6.2 14.77,42.36 14.77,43.37 15.13,43.72 16.42,43.72 17.03,43.11 RDY.+ 20.21,43.11 32.03,31.3 TRG.-
  other vias: 17.46,43.11
TTL_RXD  (via drill 0.35)
  Top 0.152: v22,29.58 21.76,29.58 20,27.82 U1.26
  Bottom 0.152: RXD.TP 26.86,37.92 26.86,35.89 23.75,32.78 23.75,31.37 22,29.62 v22,29.58 21.65,29.23 21.61,29.23 21.49,29.11 17.47,29.11 16.87,29.71 16.11,29.71 15.58,29.18 15.58,28.36 14.27,27.06 6.36,27.06 6.16,27.25 X1.19
TTL_TXD  (via drill 0.35)
  Top 0.152: v22.14,30.62 22.12,30.62 19.55,28.05 U1.27
  Bottom 0.152: TXD.TP 25.48,39.07 25.48,38.06 26.55,36.98 26.55,36.02 23.45,32.91 23.45,31.93 v22.14,30.62 20.93,29.41 17.6,29.41 16.99,30.02 15.98,30.02 15.27,29.3 15.27,28.49 14.15,27.36 6.49,27.36 6.24,27.62 6.11,27.75 X1.20
V_FOL_PWM  (via drill 0.35)
  Top 0.152: v18.43,27.56 18.43,26.53 U1.1
  Bottom 0.152: v18.43,27.56 18.48,27.51 20.46,27.51 21.9,26.07 | 21.9,26.07 | 21.9,26.07 22.8,25.17 22.8,24.8 23.41,24.19 24.07,24.19 25.16,23.1 27.47,23.1 R10.2
  other vias: 27.73,22.84
V_FOL_SENSE  (via drill 0.35)
  Top 0.152: U1.19 23.08,25.56 23.14,25.62 23.49,25.62 v23.8,25.93 | U4.8 v27.83,24.43 U4.7 | v26.76,29.36 R1.1
  Bottom 0.152: v23.8,25.93 23.8,26.08 24.24,26.51 24.24,27.11 24.59,27.47 | 24.59,27.47 25.17,27.47 25.45,27.19 25.45,26.84 27.83,24.46 v27.83,24.43 | 24.59,27.47 24.59,28.21 24.65,28.27 24.65,29.55 24.99,29.88 26.23,29.88 v26.76,29.36
V_INT  (via drill 0.35)
  Top 0.508: v15.35,20.07 arc-45 13.77,20.73 11.78,22.72 arc-45 11.51,23.37 11.51,23.45 arc45 11.18,24.24 arc45 10.37,24.57 9.29,24.57 arc-45 8.64,24.84 8.48,25 arc45 8.05,25.18 J1.P$3 J1.P$2
  Bottom 0.152: C3.1 32.46,15.36 32.46,14.87
  Bottom 0.508: FAN1.2 34.46,18.36 34.46,16.87 32.46,14.87 31.81,14.22 30.75,14.22 30.75,14.1 | 30.75,14.1 29.77,15.07 FAN0.2 | 30.75,14.1 30.75,14.07 29.6,12.92 29.51,12.92 26.46,9.87 arc-138 21.46,11.87 arc1 21.46,14.87 arc44 21.04,15.87 20.14,16.77 arc21 v15.35,20.07
VCC
  Top 0.152: J1.P$13 5.09,15.11
  Top 0.508: J1.P$11 J1.P$10 | J1.P$12 5.09,15.11 J1.P$14
  Top 1.27: J1.P$11 5.09,15.11 J1.P$15 arc90 6.78,11.49 HE0.1 HE0.2
VCC_REG  (via drill 0.35)
  Top 0.152: 5V.TP 15.04,9.61 6.36,9.61 3.19,12.79 v3.19,24.64
  Top 0.406: C2.2 14.77,28.15 14.77,26.74 14.75,26.74 14.75,26.14 F1.1 | C2.2 | C2.2 12.27,28.21 D1.P$2
  Top 0.508: v8.53,26.15 8.65,26.02 8.65,25.82 9.19,25.28 11.51,25.28 12.03,25.8 12.03,27.98 12.27,28.21
  Bottom 0.152: 5V.TP 16.52,8.2 12.43,12.29 | 12.43,12.29 C8.2 | C10.2 12.65,16.84 R12.2 12.65,15.97 13.13,15.49 13.13,12.99 12.43,12.29 | 5.73,26.04 5.6,25.91 arc-45 X1.16 4.31,25.75 v3.19,24.64
  Bottom 0.305: X1.17 5.45,26.04
  Bottom 0.508: v8.53,26.15 8.41,26.04 5.73,26.04 5.45,26.04
  other vias: 16.52,8.13
VCOMP_PWM
  Top 0.152: U1.11 20.45,21.51 R5.2
VCOMP_SENSE  (via drill 0.35)
  Top 0.152: U1.20 22.41,26.03 22.9,26.03 23.34,26.46 v23.34,26.75 23.83,26.75 23.92,26.66 24.84,26.66 | 16.3,21.24 C7.2 | R5.1 18.61,21.2 C6.2 16.45,21.2 16.3,21.05 16.3,21.24 | v16.13,21.46 16.3,21.29 16.3,21.24 | U4.1 24.84,26.66 | v24.84,26.86 24.84,26.66
  Bottom 0.152: v23.34,26.75 22.95,26.75 22.73,26.53 21.87,26.53 20.21,28.19 16.27,28.19 13.67,25.59 13.67,23.93 v16.13,21.46 | A+.TP 32.72,24.64 30.28,24.64 30.24,24.67 28.92,24.67 28.08,23.83 27.58,23.83 27.22,24.18 27.22,24.64 25,26.86 v24.84,26.86
VREF_IN
  Top 0.152: U4.9 28.79,22.98 R10.1 C4.2 28.64,20.57 C5.2
X_1A
  Bottom 0.305: X1.28 X1.27
X_1B
  Bottom 0.305: X1.30 X1.29
X_2A
  Bottom 0.305: X1.26 X1.25
X_2B
  Bottom 0.305: X1.24 X1.23
Z_MIN_TRIG  (via drill 0.35)
  Top 0.152: U1.9 19.55,22.46 19.38,22.29 19.38,20.39 arc-90 18.41,19.42 15.81,19.42 arc-40 13.67,20.07 13.65,20.07 10.64,23.07 10.37,23.35 v10.37,23.7 | 10.81,37.46 R6.1 10.81,37.47 10.81,36.7 13.35,34.16 13.35,29.72 12.71,29.08 11.44,29.08 10.3,27.94 v10.3,26.06
  Bottom 0.152: v10.3,26.06 10.37,26 v10.37,23.7 9.55,24.51 arc45 7.76,25.25 X1.15
Z_TRG
  Top 0.152: U1.28 19.1,28.43 INT.TP 21.87,31.24 23.13,31.24 23.34,31.03 R13.2

### Text on the board
tPlace: + -
bPlace: 2B 2A 1A 1B | + - | PZ1 | Fan1 | + - | Fan0 | + - | HE0 | + - | TH0